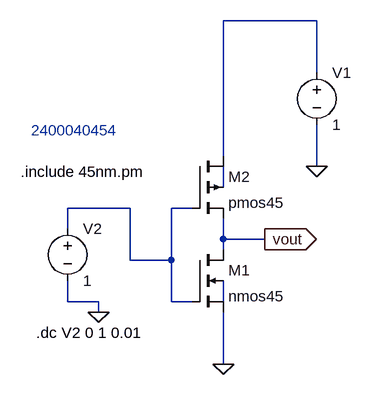
[diagram p0: schematic experiment5.asc]
experiment5.asc, the LTspice schematic file:
Version 4.1
SHEET 1 880 680
WIRE 368 -192 224 -192
WIRE 368 -112 368 -192
WIRE 224 16 224 -192
WIRE 368 32 368 -32
WIRE 224 64 224 32
WIRE 80 96 -16 96
WIRE 176 96 144 96
WIRE -16 128 -16 96
WIRE 224 144 224 112
WIRE 288 144 224 144
WIRE 224 160 224 144
WIRE 80 176 80 96
WIRE 144 176 144 96
WIRE 144 176 80 176
WIRE -16 240 -16 208
WIRE 32 240 -16 240
WIRE 144 240 144 176
WIRE 176 240 144 240
WIRE 224 240 224 208
WIRE 32 256 32 240
WIRE 224 336 224 256
FLAG 368 32 0
FLAG 224 336 0
FLAG 32 256 0
FLAG 288 144 vout
IOPIN 288 144 Out
SYMBOL nmos4 176 160 R0
SYMATTR InstName M1
SYMATTR Value nmos45
SYMATTR Value2 l=45n w=1u
SYMBOL pmos4 176 16 R0
SYMATTR InstName M2
SYMATTR Value pmos45
SYMATTR Value2 l=45n w=1u
SYMBOL voltage 368 -128 R0
WINDOW 123 0 0 Left 0
WINDOW 39 0 0 Left 0
SYMATTR InstName V1
SYMATTR Value 1
SYMBOL voltage -16 112 R0
WINDOW 123 0 0 Left 0
WINDOW 39 0 0 Left 0
SYMATTR InstName V2
SYMATTR Value 1
TEXT -64 288 Left 2 !.dc V2 0 1 0.01
TEXT -88 40 Left 2 !.include 45nm.pm
TEXT -72 -24 Left 2 ;2400040454

The netlist it stands for:
* experiment5.asc
M1 vout N003 0 N004 nmos45 l=45n w=1u
M2 N001 N003 vout N002 pmos45 l=45n w=1u
V1 N001 0 1
V2 N003 0 1
.model NMOS NMOS
.model PMOS PMOS
.lib standard.mos
.dc V2 0 1 0.01
.include 45nm.pm
* 2400040454
.backanno
.end